# Altium schematic sheet LscanLVDSdriver.SchDoc
size A4
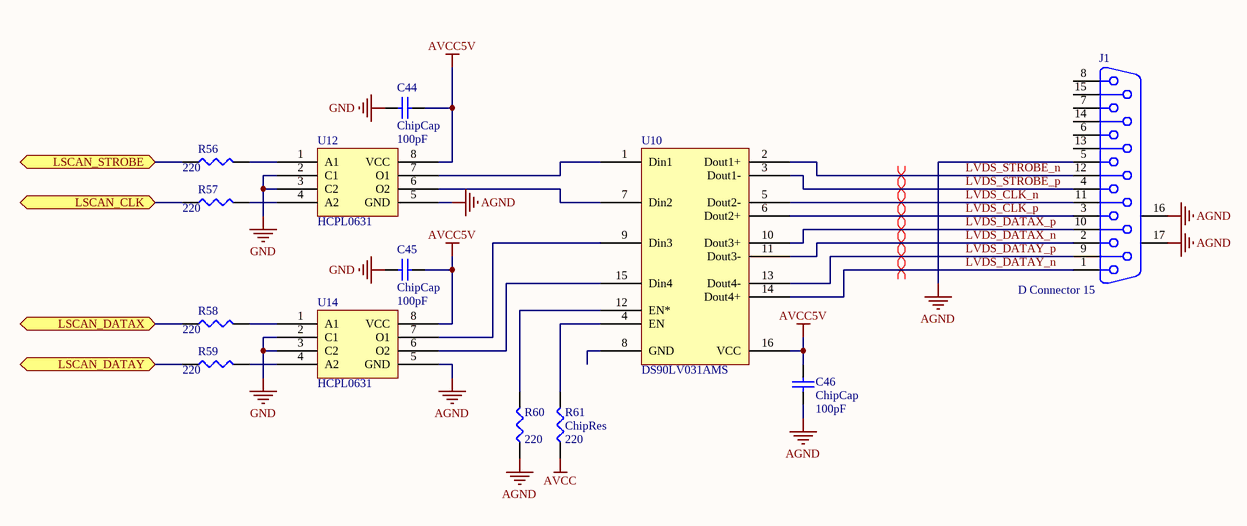
[diagram p0: LscanLVDSdriver.SchDoc]

## Parts
C44  ChipCap  value 100pF  [CAP0805]
C45  ChipCap  value 100pF  [CAP0805]
C46  ChipCap  value 100pF  [CAP0805]
J1  D Connector 15  [DSUB1.385-2H15]
R56  value 220  [RES0805]  (hidden comment: ChipRes)
R57  value 220  [RES0805]  (hidden comment: ChipRes)
R58  value 220  [RES0805]  (hidden comment: ChipRes)
R59  value 220  [RES0805]  (hidden comment: ChipRes)
R60  value 220  [RES0805]  (hidden comment: ChipRes)
R61  ChipRes  value 220  [RES0805]
U10  DS90LV031AMS  [SOIC16]
U12  HCPL0631  [SOIC8]
U14  HCPL0631  [SOIC8]

## Ports
LSCAN_CLK, LSCAN_DATAX, LSCAN_DATAY, LSCAN_STROBE

## Nets
AGND: C46.1 J1.5 J1.16(MH1) J1.17(MH2) R60.1 U12.5(GND) U14.5(GND)
AVCC: R61.1
AVCC5V: C44.1 C45.1 C46.2 U10.16(VCC) U12.8(VCC) U14.8(VCC)
GND: C44.2 C45.2 U12.2(C1) U12.3(C2) U14.2(C1) U14.3(C2)
LSCAN_CLK: R57.1 ; port LSCAN_CLK
LSCAN_DATAX: R58.1 ; port LSCAN_DATAX
LSCAN_DATAY: R59.1 ; port LSCAN_DATAY
LSCAN_STROBE: R56.1 ; port LSCAN_STROBE
LVDS_CLK_n: J1.11 U10.5(Dout2-)
LVDS_CLK_p: J1.3 U10.6(Dout2+)
LVDS_DATAX_n: J1.2 U10.11(Dout3-)
LVDS_DATAX_p: J1.10 U10.10(Dout3+)
LVDS_DATAY_n: J1.1 U10.14(Dout4+)
LVDS_DATAY_p: J1.9 U10.13(Dout4-)
LVDS_STROBE_n: J1.12 U10.2(Dout1+)
LVDS_STROBE_p: J1.4 U10.3(Dout1-)
NetR56_2: R56.2 U12.1(A1)
NetR57_2: R57.2 U12.4(A2)
NetR58_2: R58.2 U14.1(A1)
NetR59_2: R59.2 U14.4(A2)
NetR60_2: R60.2 U10.12(EN*)
NetR61_2: R61.2 U10.4(EN)
NetU10_1: U10.1(Din1) U12.7(O1)
NetU10_7: U10.7(Din2) U12.6(O2)
NetU10_9: U10.9(Din3) U14.7(O1)
NetU10_15: U10.15(Din4) U14.6(O2)

Not connected (* = marked no-connect by the designer): J1 6 7 8 13 14 15; U10 8(GND)

## Layout directives
differential pair: LVDS_CLK_n, LVDS_CLK_p, LVDS_DATAX_n, LVDS_DATAX_p, LVDS_DATAY_n, LVDS_DATAY_p, LVDS_STROBE_n, LVDS_STROBE_p

## Library data of the parts
C44-C46 = ChipCap: Capacitor; Published: 8-Jun-2000; LatestRevisionDate: 17-Jul-2002; LatestRevisionNote: Re-released for DXP Platform.; PackageReference: RAD-0.3; Publisher: Altium Limited
J1 = D Connector 15: Receptacle Assembly, 15 Position, Right Angle; PackageDocument: O; Positions: 15; Published: 15-Jun-2001; LatestRevisionDate: 17-Jul-2002; LatestRevisionNote: Re-released for DXP Platform.; DatasheetDocument: 1-Sep-99; PackageReference: 788757; Publisher: Altium Limited; Orientation: Right Angle; Gender: Receptacle
R56-R61 = ChipRes: Chip resistor
U10 = DS90LV031AMS: 3V LVDS Quad CMOS Differential Line Driver
U12 U14 = HCPL0631: 2-channel opto-coupler